# Altium schematic sheet IEEE-802.15.4.SchDoc: TB - Module RF OFDM 869 MHz
size A3; Author: Yann Charbon; SheetNumber: 1
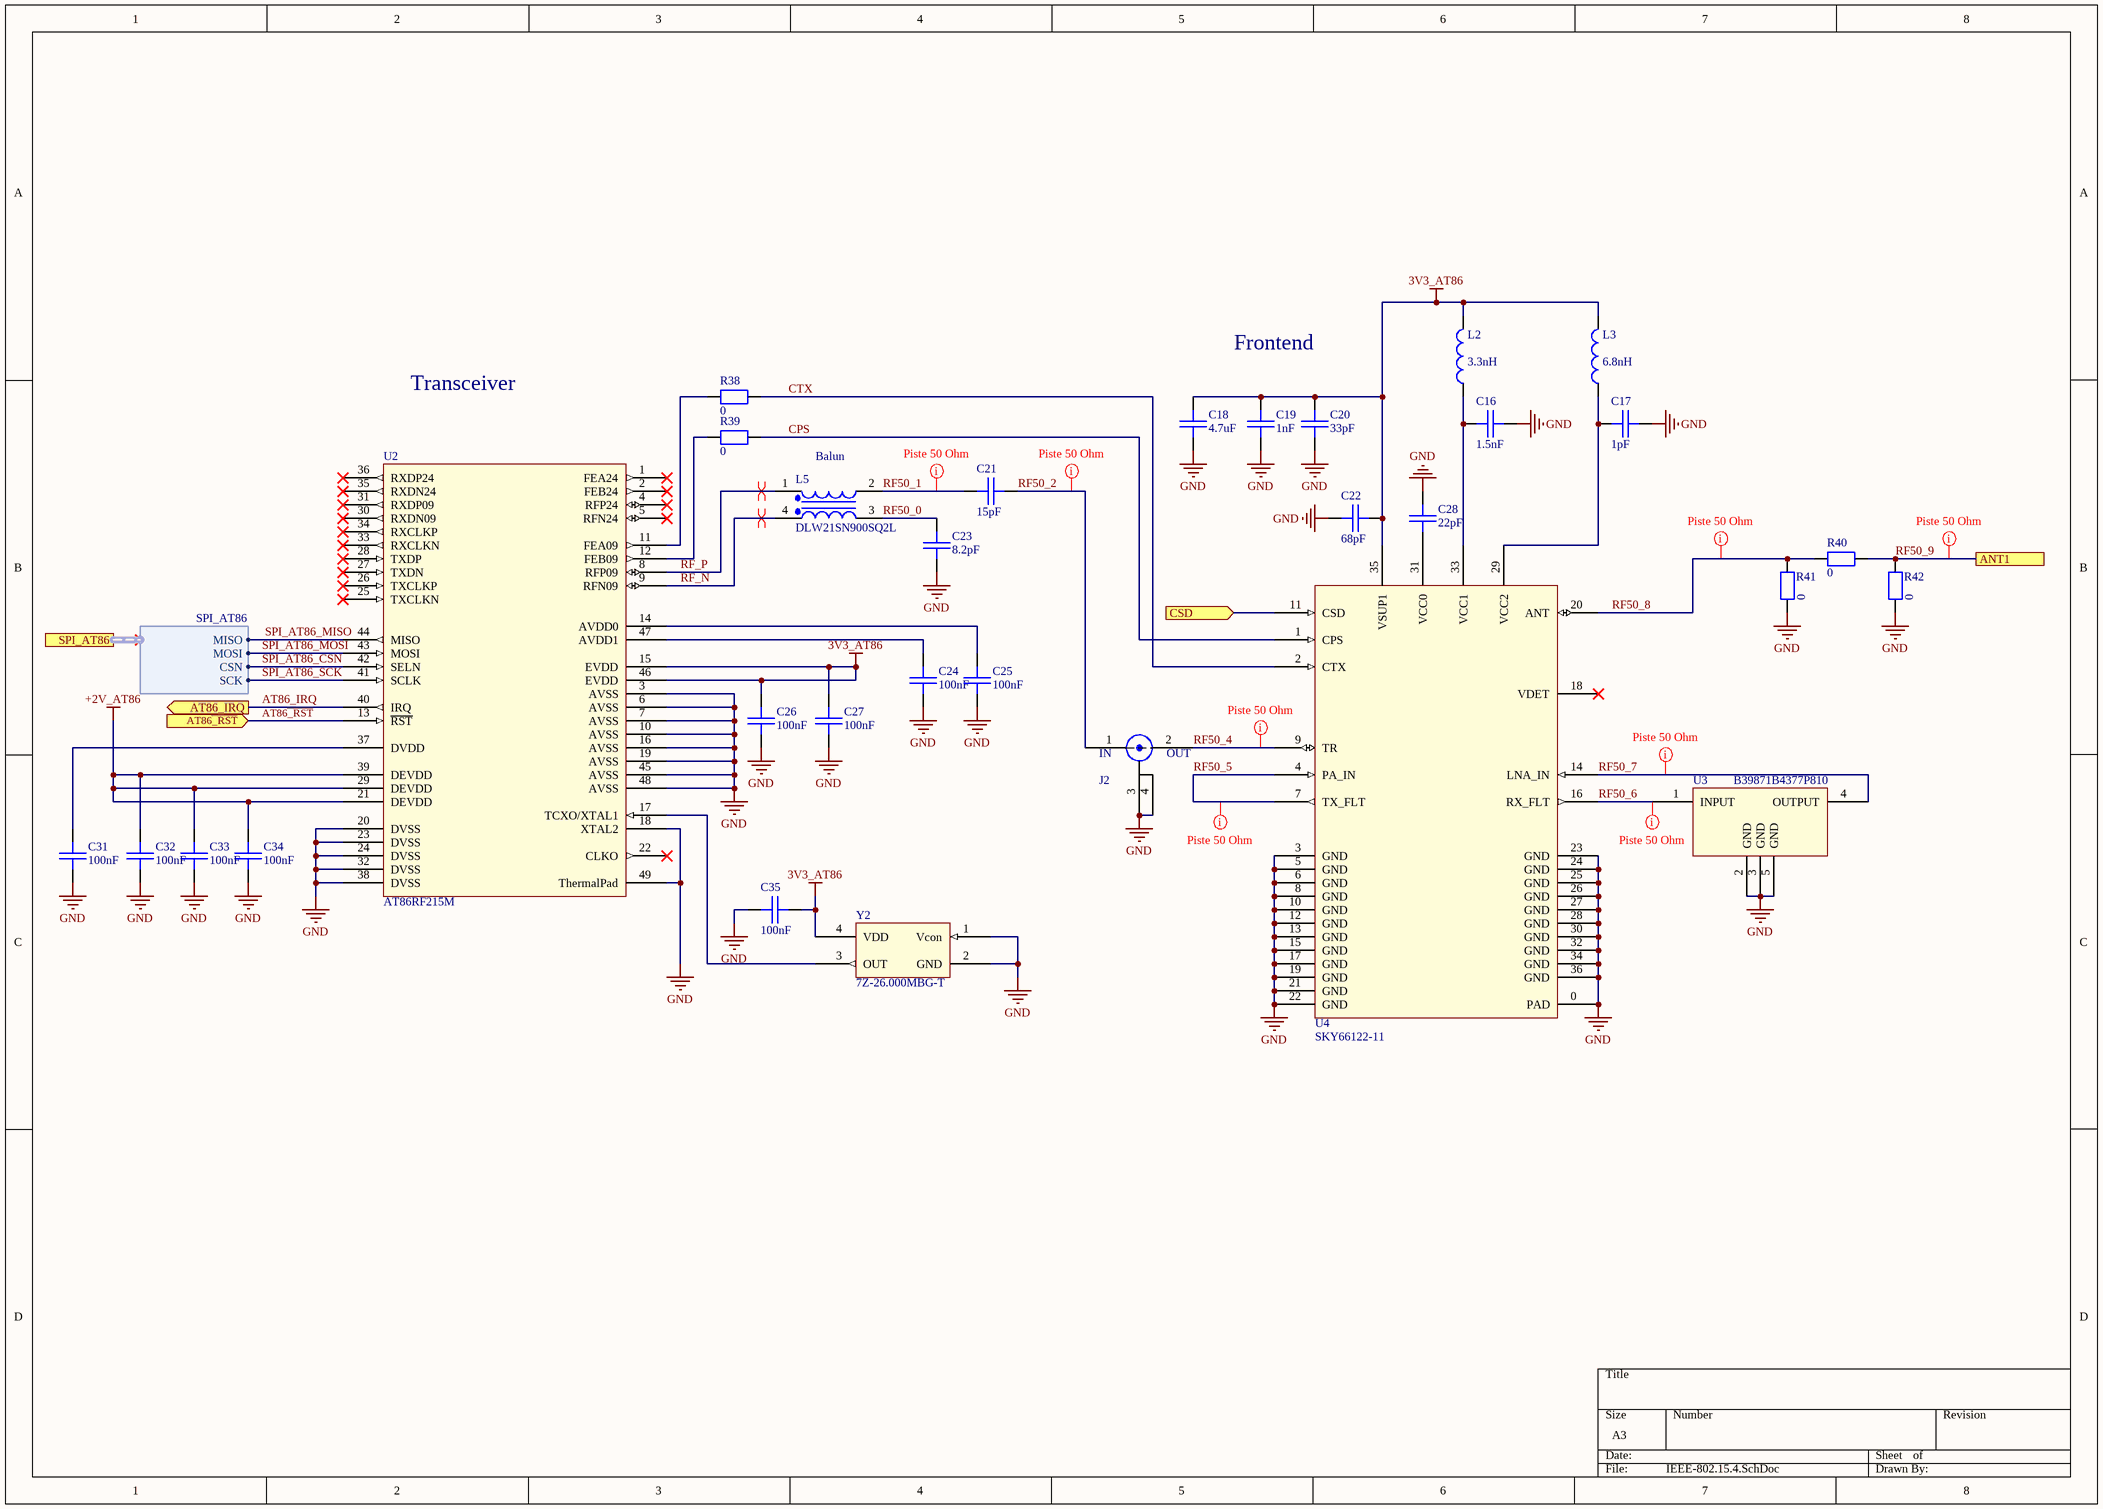
[diagram p0: IEEE-802.15.4.SchDoc]

## Parts
C16  value 1.5nF  [SM/C_0402]  (hidden comment: C-1nF-0402)
C17  value 1pF  [SM/C_0402]  (hidden comment: C-1pF-0402)
C18  value 4.7uF  [SM/C_0603]  (hidden comment: C-4.7uF-0603)
C19  value 1nF  [SM/C_0402]  (hidden comment: C-1nF-0402)
C20  value 33pF  [SM/C_0402]  (hidden comment: C-33pF-0402)
C21  value 15pF  [SM/C_0402]  (hidden comment: C-15pF-0402)
C22  value 68pF  [SM/C_0402]  (hidden comment: C-68pF-0402)
C23  value 8.2pF  [SM/C_0402]  (hidden comment: C-8.2pF-0402)
C24  value 100nF  [SM/C_0402]  (hidden comment: C-100nF-0402)
C25  value 100nF  [SM/C_0402]  (hidden comment: C-100nF-0402)
C26  value 100nF  [SM/C_0402]  (hidden comment: C-100nF-0402)
C27  value 100nF  [SM/C_0402]  (hidden comment: C-100nF-0402)
C28  value 22pF  [SM/C_0402]  (hidden comment: C-22pF-0402)
C31  value 100nF  [SM/C_0402]  (hidden comment: C-100nF-0402)
C32  value 100nF  [SM/C_0402]  (hidden comment: C-100nF-0402)
C33  value 100nF  [SM/C_0402]  (hidden comment: C-100nF-0402)
C34  value 100nF  [SM/C_0402]  (hidden comment: C-100nF-0402)
C35  value 100nF  [SM/C_0402]  (hidden comment: C-100nF-0402)
J2  MM8930-2620RJ4  [MM8030-2610RJ3]  (value not drawn)
L2  value 3.3nH  [SM/L_0402]  (hidden comment: L-3.3nH-0402)
L3  value 6.8nH  [SM/L_0603 (1608)]  (hidden comment: L-6.8nH-0603)
L5  DLW21SN900SQ2L  [MURA-DLW21SN900SQ2L-4_V]
R38  value 0  [SM/R_0402]  (hidden comment: R-0-0402)
R39  value 0  [SM/R_0402]  (hidden comment: R-0-0402)
R40  value 0  [SM/R_0402]  (hidden comment: R-0-0402)
R41  value 0  [SM/R_0402]  (hidden comment: R-0-0402)
R42  value 0  [SM/R_0402]  (hidden comment: R-0-0402)
U2  AT86RF215M  [QFN50P700X700X90-49N-D]
U3  B39871B4377P810  [B39871B4377P810]
U4  SKY66122-11  [SKY66122-11]
Y2  7Z-26.000MBG-T  [7Z-26.000MBG-T]

## Ports
ANT1, AT86_IRQ (out), AT86~{_RST} (in), CSD (in), SPI_AT86 (harness SPI_AT86)

## Harnesses
SPI_AT86: MISO, MOSI, CSN, SCK

## Nets
3V3_AT86: C18.2 C19.2 C20.2 C22.2 C26.2 C27.2 C35.1 L2.2 L3.2 U2.15(EVDD) U2.46(EVDD) U4.35(VSUP1) Y2.4(VDD)
+2V_AT86: C32.2 C33.2 C34.2 U2.21(DEVDD) U2.29(DEVDD) U2.39(DEVDD)
GND: C16.2 C17.2 C18.1 C19.1 C20.1 C22.1 C23.1 C24.1 C25.1 C26.1 C27.1 C28.2 C31.1 C32.1 C33.1 C34.1 C35.2 J2.3(GND) J2.4(GND) R41.1 R42.1 U2.3(AVSS) U2.6(AVSS) U2.7(AVSS) U2.10(AVSS) U2.16(AVSS) U2.18(XTAL2) U2.19(AVSS) U2.20(DVSS) U2.23(DVSS) U2.24(DVSS) U2.32(DVSS) U2.38(DVSS) U2.45(AVSS) U2.48(AVSS) U2.49(ThermalPad) U3.2(GND) U3.3(GND) U3.5(GND) U4.0(PAD) U4.3(GND) U4.5(GND) U4.6(GND) U4.8(GND) U4.10(GND) U4.12(GND) U4.13(GND) U4.15(GND) U4.17(GND) U4.19(GND) U4.21(GND) U4.22(GND) U4.23(GND) U4.24(GND) U4.25(GND) U4.26(GND) U4.27(GND) U4.28(GND) U4.30(GND) U4.32(GND) U4.34(GND) U4.36(GND) Y2.1(Vcon) Y2.2(GND)
AT86~{_RST}: U2.13(~{RST}) ; port AT86~{_RST}
AT86_IRQ: U2.40(IRQ) ; port AT86_IRQ
CPS: R39.2 U4.1(CPS)
CSD: U4.11(CSD) ; port CSD
CTX: R38.2 U4.2(CTX)
RF50_0: C23.2 L5.3
RF50_1: C21.1 L5.2
RF50_2: C21.2 J2.1(IN)
RF50_4: J2.2(IN) U4.9(TR)
RF50_5: U4.4(PA_IN) U4.7(TX_FLT)
RF50_6: U3.1(INPUT) U4.16(RX_FLT)
RF50_7: U3.4(OUTPUT) U4.14(LNA_IN)
RF50_8: R40.1 R41.2 U4.20(ANT)
RF50_9: R40.2 R42.2 ; port ANT1
RF_N: L5.4 U2.9(RFN09)
RF_P: L5.1 U2.8(RFP09)
SPI_AT86_CSN: U2.42(SELN) ; port SPI_AT86.CSN
SPI_AT86_MISO: U2.44(MISO) ; port SPI_AT86.MISO
SPI_AT86_MOSI: U2.43(MOSI) ; port SPI_AT86.MOSI
SPI_AT86_SCK: U2.41(SCLK) ; port SPI_AT86.SCK
NetC16_1: C16.1 L2.1 U4.33(VCC1)
NetC17_1: C17.1 L3.1 U4.29(VCC2)
NetC24_2: C24.2 U2.47(AVDD1)
NetC25_2: C25.2 U2.14(AVDD0)
NetC28_1: C28.1 U4.31(VCC0)
NetC31_2: C31.2 U2.37(DVDD)
NetR38_1: R38.1 U2.11(FEA09)
NetR39_1: R39.1 U2.12(FEB09)
NetU2_17: U2.17(TCXO/XTAL1) Y2.3(OUT)

Not connected (* = marked no-connect by the designer): U2 1(FEA24)* 2(FEB24)* 4(RFP24)* 5(RFN24)* 22(CLKO)* 25(TXCLKN)* 26(TXCLKP_)* 27(TXDN)* 28(TXDP)* 30(RXDN09)* 31(RXDP09)* 33(RXCLKN)* 34(RXCLKP)* 35(RXDN24)* 36(RXDP24)*; U4 18(VDET)*

## Layout directives
differential pair: RF_N, RF_P
rule Impedance Constraint [Min = 48.00    Max = 52.00    ]: RF50_2, RF50_4, RF50_5, RF50_6, RF50_7
mark named Piste 50 Ohm: RF50_1, RF50_8, RF50_9

## Notes on the sheet
- Frontend
- Transceiver
- (near L5) Balun
- (in symbol MM8030-2610RJ3) OUT

## Library data of the parts
C16 = C-1.5nF-0402: Supplier 1: Digi-Key; Supplier Part Number 1: 478-12618-1-ND
C18 = C-4.7uF-0603: Voltage: 6.3V; Fabricant_Ref: GRM188R60J475KE19D; Fabricant: Murata; Tolerance: 10%; Technologie: X5R; ESR: *; IRMS: *; Supplier Part Number 1b: 490-3297-6-ND; Supplier 1b: DigiReel; Supplier 1: Digi-Key; Supplier Part Number 1: 490-7203-1-ND
C19 = C-1nF-0402: Voltage: 50V; Fabricant_Ref: GRM1555C1H102FA01D; Fabricant: Murata; Tolerance: 1%; Technologie: NPO; ESR: *; IRMS: *; Supplier 1: Digi-Key; Supplier Part Number 1: 490-6189-1-ND; Supplier 2: Mouser; Supplier Part Number 2: 81-GRM1555C1H102FA1D; Supplier 1b: DigiReel; Supplier Part Number 1b: 490-6189-6-ND
C20 = C-33pF-0402: Voltage: 50V; Fabricant_Ref: C1005C0G1H330J050BA; Fabricant: TDK; Tolerance: 5%; Technologie: NPO; ESR: *; IRMS: *; Supplier 1: Digi-Key; Supplier Part Number 1: 445-1241-1-ND; Supplier 1b: DigiReel; Supplier 2: Mouser; Supplier Part Number 1b: 445-1241-6-ND; Supplier Part Number 2: 810-C1005C0G1H330J
C21 = C-15pF-0402: Voltage: 6.3V; Fabricant_Ref: GRM188R60J475KE19D; Fabricant: Murata; Tolerance: 10%; Technologie: X5R; ESR: *; IRMS: *; Supplier Part Number 1b: 490-3297-6-ND; Supplier 1b: DigiReel; Supplier 1: Digi-Key; Supplier Part Number 1: 490-11191-1-ND
C22 = C-68pF-0402: Voltage: 50V; Fabricant_Ref: C1005C0G1H330J050BA; Fabricant: TDK; Tolerance: 5%; Technologie: NPO; ESR: *; IRMS: *; Supplier 1b: DigiReel; Supplier Part Number 1b: 445-1241-6-ND; Supplier 1: Digi-Key; Supplier Part Number 1: 478-1080-1-ND
C23 = C-8.2pF-0402: Voltage: 6.3V; Fabricant_Ref: GRM188R60J475KE19D; Fabricant: Murata; Tolerance: 10%; Technologie: X5R; ESR: *; IRMS: *; Supplier Part Number 1b: 490-3297-6-ND; Supplier 1b: DigiReel; Supplier 1: Digi-Key; Supplier Part Number 1: 490-11240-1-ND
C24-C27 C31-C35 = C-100nF-0402: Voltage: 25V; Fabricant_Ref: GRM155R71H103KA88J; Fabricant: Murata; Tolerance: 10%; Technologie: X7R; ESR: *; IRMS: *; Supplier 1: Digi-Key; Supplier Part Number 1: 1276-6720-1-ND; Supplier 2: Mouser; Supplier Part Number 2: 710-885012205037
C28 = C-22pF-0402: Voltage: 50V; Fabricant_Ref: GRM1555C1H220FA01D; Fabricant: Murata; Tolerance: 1%; Technologie: NPO; ESR: *; IRMS: *; Supplier 1: Digi-Key; Supplier Part Number 1: 490-8589-1-ND; Supplier 2: Mouser; Supplier Part Number 2: 81-GRM1555C1H220FA1D
J2 = MM8030-2610RJ3: SWG Connecteur Socle, prise femelle 50Ohms; RoHS: No; Supplier 1: Digi-Key; Supplier Part Number 1: 490-5907-1-ND
L2 = L-3.3nH-0402: I_DC: 300mA; Tolerance: 0.3nH; Fabricant: Murata; Fabricant_Ref: LQG15HN3N3S02D; Supplier 1: Digi-Key; Supplier Part Number 1: 490-6561-1-ND; Supplier 1b: DigiReel; Supplier 2: Mouser; Supplier Part Number 1b: 490-6561-6-ND; Supplier Part Number 2: 81-LQG15HN3N0S02D
L3 = L-6.8nH-0603: I_DC: 300mA; Tolerance: 5%; Fabricant: Murata; Fabricant_Ref: LQG18HN6N8J00D; Supplier 1: Digi-Key; Supplier Part Number 1: 490-1108-1-ND; Supplier 1b: DigiReel; Supplier 2: Mouser; Supplier Part Number 1b: 490-1108-6-ND; Supplier Part Number 2: 81-LQG18HN6N8J00D
L5 = DLW21SN900SQ2L: Chip Common Mode Choke Coil, 90 Ohm, 330 mA, -40 to 85 degC, 4-Pin SMD, RoHS, Tape and Reel; Manufacturer: Murata; DC Resistance-Max: 0.41O; Impedance: 90O; Rated Voltage: 50V; Rated Current: 280mA; Manufacturer URL: http://www.murata.com/; Case Size/Dimension: 0805; Datasheet URL: http://www.murata.com/zh-cn/products/productdata/8796757917726/EFLC0003.pdf?1441769419000; Datasheet Version: Aug-14; Supplier 1: Digi-Key; Supplier Part Number 1: 490-5137-1-ND
R38-R42 = R-0-0402: Fabricant_Ref: ERJ-2GE0R00X; Fabricant: Panasonic; Puissance: 100 mW; Tolerance: 1%; Tension: 50V; Supplier 1: Digi-Key; Supplier Part Number 1: P0.0JCT-ND; Supplier 1b: DigiReel; Supplier 2: Mouser; Supplier Part Number 1b: P0.0JDKR-ND; Supplier Part Number 2: 667-ERJ-2GE0R00X
U2 = AT86RF215M: IC RF TXRX 802.15.4/ISM 48-VFQFN; Supplier 1: Digi-Key; Supplier Part Number 1: AT86RF215M-ZU-ND
Y2 = 7Z-26.000MBG-T: XTAL OSC TCXO 26.0000MHZ SNWV; Frequency Stability: 1ppm; Frequency: 26MHz; Max Supply Current: 2mA; Supplier 1: Digi-Key; RoHS: Yes; Mount: Surface Mount; Case/Package: SMD/SMT; Min Operating Temperature: -40°C; Max Operating Temperature: 85°C; Packaging: Tape and Reel; Length: 0.126inch; Height: 0.039inch; Width: 0.098inch; ComponentLink1URL: http://www.taitien.com/wp-content/uploads/2015/12/XO-0076_TX.pdf?src-supplier=Digi-Key; ComponentLink1Description: http://www.taitien.com/wp-content/uploads/2015/12/XO-0076_TX.pdf?src-supplier=Digi-Key; Supplier Part Number 1: 887-1620-1-ND
C17 = C-1pF-0402: Supplier 1: Digi-Key; Supplier Part Number 1: 1276-1595-1-ND
U3 = B39871B4377P810: Supplier 1: Mouser; Supplier Part Number 1: 871-B39871B4377P810
U4 = SKY66122-11: Supplier 1: Digi-Key; Supplier Part Number 1: 863-SKY66122-11CT-ND